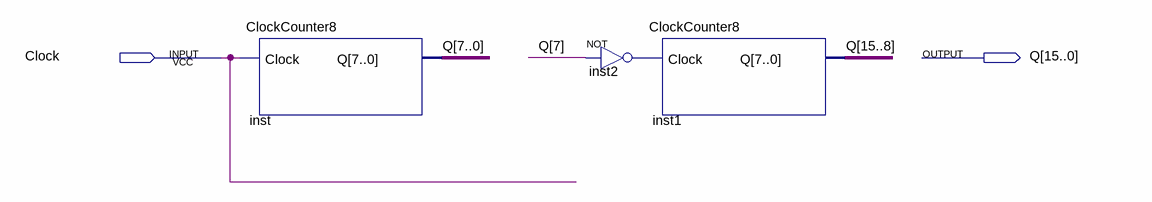
[diagram p0: schematic sheet]
// Quartus schematic ClockCounter16.bdf as structural Verilog: 3 symbols, 2 pins
module ClockCounter16 (
  input  Clock,
  output [15:0] Q
);

  wire inst2_out;

  ClockCounter8 inst (.Clock(Clock), .Q(Q[7:0]));
  not inst2 (inst2_out, Q[7]);
  ClockCounter8 inst1 (.Clock(inst2_out), .Q(Q[15:8]));
endmodule
